# Altium schematic sheet Sheet1.SchDoc
size A3; SheetNumber: 1; SheetTotal: 1
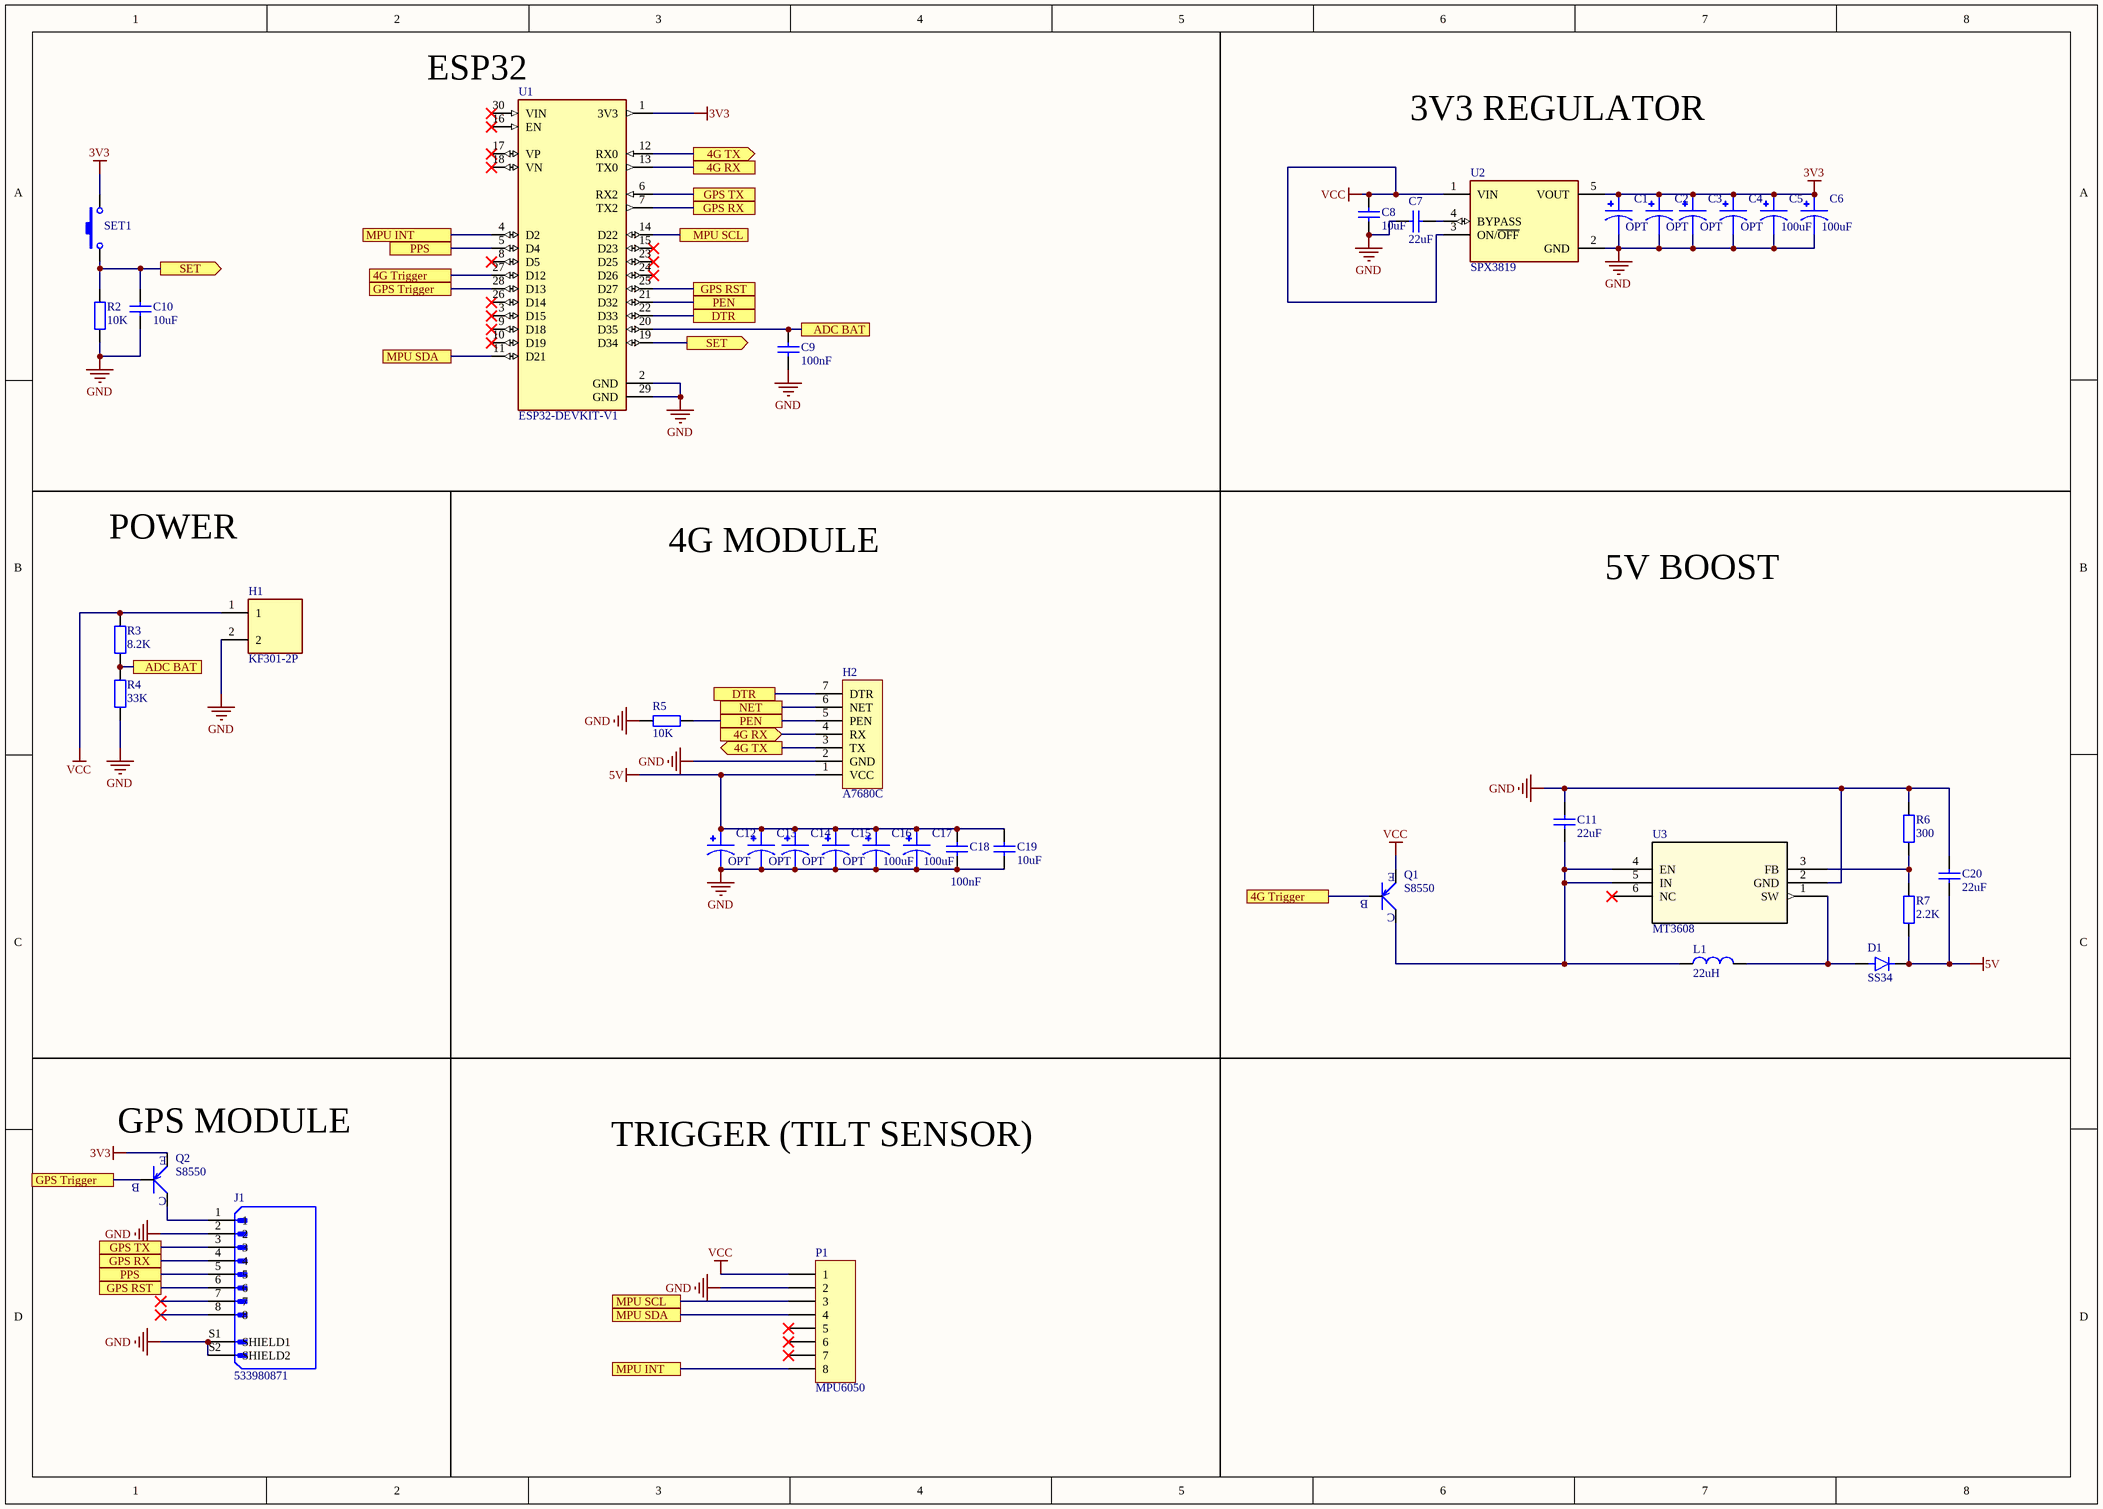
[diagram p0: Sheet1.SchDoc]

## Parts
C1  OPT  [1206_Tantalum]
C2  OPT  [1206_Tantalum]
C3  OPT  [2312_Tantalum]
C4  OPT  [2312_Tantalum]
C5  100uF  [2917 _Tantalum]
C6  100uF  [2917 _Tantalum]
C7  22uF  [0805_Cap]
C8  10uF  [0805_Cap]
C9  100nF  [0805_Cap]
C10  10uF  [0805_Cap]
C11  22uF  [0805_Cap]
C12  OPT  [1206_Tantalum]
C13  OPT  [1206_Tantalum]
C14  OPT  [2312_Tantalum]
C15  OPT  [2312_Tantalum]
C16  100uF  [2917 _Tantalum]
C17  100uF  [2917 _Tantalum]
C18  100nF  [0805_Cap]
C19  10uF  [0805_Cap]
C20  22uF  [0805_Cap]
D1  SS34  [SODFL5226X100N]
H1  KF301-2P  [HANDSON_KF301-2P]
H2  A7680C  [Module A7680C]
J1  533980871  [MOLEX_533980871]
L1  22uH  [INDUCTOR CDRH104]
P1  MPU6050  [HDR1X8]
Q1  S8550  [SOT23]
Q2  S8550  [SOT23]
R2  10K  [0805_Res]
R3  8.2K  [0805_Res]
R4  33K  [0805_Res]
R5  10K  [0805_Res]
R6  300  [0805_Res]
R7  2.2K  [0805_Res]
SET1  Button 2p  [Button 2p 3x6x2.5]  (value not drawn)
U1  ESP32-DEVKIT-V1  [MODULE_ESP32_DEVKIT_V1]
U2  SPX3819  [SOT95P280X145-5N]
U3  MT3608  [TSOT23-6SOT23-6_AER]

## Ports
4G RX, 4G RX (in), 4G Trigger, 4G TX (out), ADC BAT, DTR, GPS RST, GPS RX, GPS Trigger, GPS TX, MPU INT, MPU SCL, MPU SDA, NET, PEN, PPS, SET (out)

## Nets
3V3: C1.1 C2.1 C3.1 C4.1 C5.1 C6.1 Q2.2(E) SET1.2 U1.1(3V3) U2.5(VOUT)
5V: C12.1 C13.1 C14.1 C15.1 C16.1 C17.1 C18.1 C19.2 C20.1 D1.1(K) H2.1(VCC) R7.1
GND: C1.2 C2.2 C3.2 C4.2 C5.2 C6.2 C7.2 C8.1 C9.1 C10.2 C11.1 C12.2 C13.2 C14.2 C15.2 C16.2 C17.2 C18.2 C19.1 C20.2 H1.2 H2.2(GND) J1.2 J1.S1(SHIELD1) J1.S2(SHIELD2) P1.2 R2.1 R4.1 R5.2 R6.2 U1.2(GND) U1.29(GND) U2.2(GND) U3.2(GND)
VCC: C8.2 H1.1 P1.1 Q1.2(E) R3.2 U2.1(VIN) U2.3(ON/~{OFF})
4G RX: H2.4(RX) U1.13(TX0) ; port 4G RX
4G Trigger: Q1.1(B) U1.27(D12) ; port 4G Trigger
4G TX: H2.3(TX) U1.12(RX0) ; port 4G TX
ADC BAT: C9.2 R3.1 R4.2 U1.20(D35) ; port ADC BAT
DTR: H2.7(DTR) U1.22(D33) ; port DTR
GPS RST: J1.6 U1.25(D27) ; port GPS RST
GPS RX: J1.4 U1.7(TX2) ; port GPS RX
GPS Trigger: Q2.1(B) U1.28(D13) ; port GPS Trigger
GPS TX: J1.3 U1.6(RX2) ; port GPS TX
MPU INT: P1.8 U1.4(D2) ; port MPU INT
MPU SCL: P1.3 U1.14(D22) ; port MPU SCL
MPU SDA: P1.4 U1.11(D21) ; port MPU SDA
NET: H2.6(NET) ; port NET
PEN: H2.5(PEN) R5.1 U1.21(D32) ; port PEN
PPS: J1.5 U1.5(D4) ; port PPS
SET: C10.1 R2.2 SET1.1 U1.19(D34) ; port SET
NetC7_1: C7.1 U2.4(BYPASS)
NetC11_2: C11.2 L1.1 Q1.3(C) U3.4(EN) U3.5(IN)
NetD1_2: D1.2(A) L1.2 U3.1(SW)
NetJ1_1: J1.1 Q2.3(C)
NetR6_1: R6.1 R7.2 U3.3(FB)

Not connected (* = marked no-connect by the designer): J1 7* 8*; P1 5* 6* 7*; U1 3(D15)* 8(D5)* 9(D18)* 10(D19)* 15(D23)* 16(EN)* 17(VP)* 18(VN)* 23(D25)* 24(D26)* 26(D14)* 30(VIN)*; U3 6(NC)*

## Notes on the sheet
- (near U1) ESP32
- 3V3 REGULATOR
- POWER
- 4G MODULE
- 5V BOOST
- (near Q2) GPS MODULE
- TRIGGER (TILT SENSOR)

## Library data of the parts
C1-C6 C12-C17 = Tantalum: Molded Tantalum Capacitors
C7 C8 = Ceramic Capacitor_1: Chung_Loai: Dán; Don_Vi: Con; So_Chan: 2; Ten_Linh_Kien: Tụ 0805 104-100nF 10% 50V; Ma_Hang: MH004551; Kieu_Chan: *
C9-C11 C18-C20 = Ceramic Capacitor: Chung_Loai: Dán; Don_Vi: Con; So_Chan: 2; Ten_Linh_Kien: Tụ 0805 104-100nF 10% 50V; Ma_Hang: MH004551; Kieu_Chan: *
D1 = SS34ALH: 3A, 40V, Schottky Rectifier; MF: Taiwan Semiconductor; Package: DO-221AC Taiwan Semiconductor; MP: SS34ALH; Value: *; SnapEDA_Link: https://www.snapeda.com/parts/SS34ALH/Taiwan+Semiconductor/view-part/?ref=snap; Availability: Not in stock; Price: None; Check_prices: https://www.snapeda.com/parts/SS34ALH/Taiwan+Semiconductor/view-part/?ref=eda
H1 = KF301-2P: 2 Pin Terminal Block 5mm Pitch; Price: None; Value: *; MP: KF301-2P; Package: None; Availability: Unavailable
H2 = Module A7680C: SIM Module A7680C; A7672S 4G
J1 = 533980871: MX 1.25mm 8 pin;Conn; Rect; Header; 1.25 mm Pitch; PCB; 8 Cir; Ver; SMT; PicoBlade; LF | Molex Incorporated 53398-0871; Price: None; MP: 533980871; Availability: Unavailable; Value: *; Package: None
L1 = Inductor: Inductors from EPCOS include SMT Inductors, SMT Power Inductors, Transponder Coils, ISDN Transformers, xDSL Transformers, DC/DC Converters, RF Transformers and SMT Current Sense Transformers.; MP: B82477G4472M000; Price: None; SnapEDA_Link: https://www.snapeda.com/parts/B82477G4472M000/EPCOS/view-part/?ref=snap; Package: NON STANDARD-2 EPCOS; Value: *; Check_prices: https://www.snapeda.com/parts/B82477G4472M000/EPCOS/view-part/?ref=eda; Availability: In Stock; MF: EPCOS; Purchase-URL: https://pricing.snapeda.com/search/part/B82477G4472M000/?ref=eda
P1 = Header 8: Module MPU6050; LatestRevisionDate: 17-Jul-2002; LatestRevisionNote: Re-released for DXP Platform.; Publisher: Altium Limited
Q1 Q2 = S8550: Bipolar (BJT) Transistor PNP SOT-23; MF: UMW; MP: S8050; Purchase-URL: https://banlinhkien.com/s8050-sot23-trans-npn-0.5a-40v-j3y-10c-p15943539.html; Check_prices: https://banlinhkien.com/s8050-sot23-trans-npn-0.5a-40v-j3y-10c-p15943539.html; SnapEDA_Link: https://www.snapeda.com/parts/S8050/Umwelt+Sensor+Teknik/view-part/?ref=snap; Price: None; Availability: In Stock; Package: None; Value: *
R2-R7 = Resistor: Chung_Loai: Dán; Don_Vi: Con; So_Chan: 2; Ten_Linh_Kien: Trở 0805 1% 1k; Ma_Hang: MH005468; Kieu_Chan: *
SET1 = Button 2p: Nut Nhan 2 Chan SMD 3x6x2.5; Ma_Hang: MH001036; Ten: Nút Nhấn 2 Chân 3x6x2.5MM SMD
U1 = ESP32-DEVKIT-V1: Dual core, Wi-Fi: 2.4 GHz up to 150 Mbits/s,BLE (Bluetooth Low Energy) and legacy Bluetooth, 32 bits, Up to 240 MHz; MF: Do it; Price: None; Availability: Not in stock; Package: None; MP: ESP32-DEVKIT-V1; Value: *; SnapEDA_Link: https://www.snapeda.com/parts/ESP32-DEVKIT-V1/Do+it/view-part/?ref=snap; Check_prices: https://www.snapeda.com/parts/ESP32-DEVKIT-V1/Do+it/view-part/?ref=eda
U2 = LP2985-33DBVR: 150-mA, 16-V, low-dropout voltage regulator with enable 5-SOT-23 -40 to 125; Package: None; Value: *; Price: None; MP: LP2985-33DBVR; Availability: Unavailable
U3 = MT3608: No Description Available; Mfr_Name: Aerosemi; RefDes: RefDes; Type: Type